# EAGLE design SMARTCONTROL (EAGLE 9.4.2)
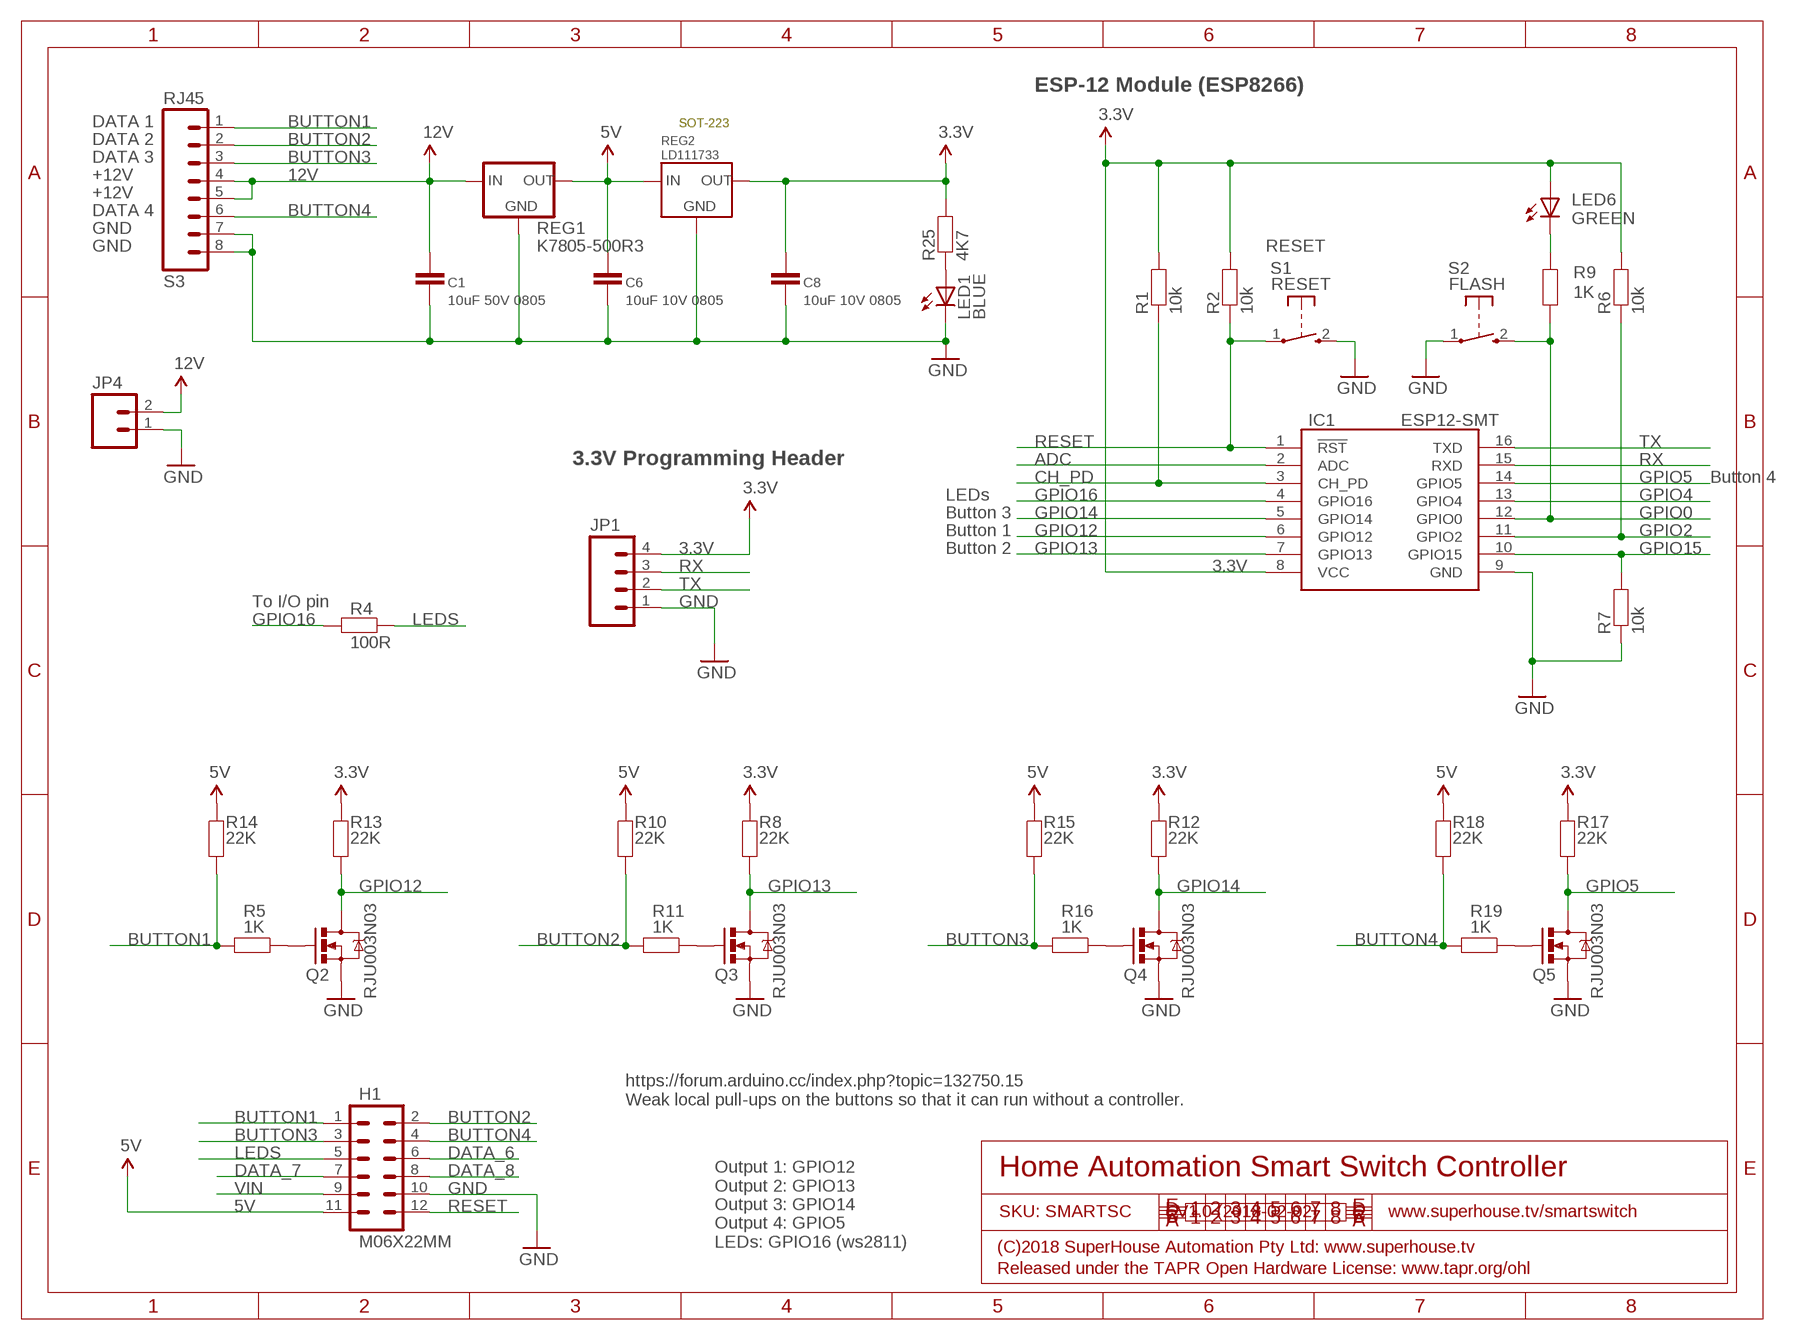
[diagram p0: schematic, sheet 1]

## Parts
C1  10uF 50V 0805  CAP0805  [C0805]
C6  10uF 10V 0805  CAP0805  [C0805]
C8  10uF 10V 0805  CAP0805  [C0805]
H1  M06X22MM  [2X6-2MM]
IC1  ESP12-SMT  [ESP12]
JP1  M04PTH  [1X04]
JP4  M023.5MM  [SCREWTERMINAL-3.5MM-2]
LED1  BLUE  LED0603  [LED-0603]
LED6  GREEN  LED0603  [LED-0603]
Q2  RJU003N03  MOSFET-NCHANNEL-323  [SOT32-3]
Q3  RJU003N03  MOSFET-NCHANNEL-323  [SOT32-3]
Q4  RJU003N03  MOSFET-NCHANNEL-323  [SOT32-3]
Q5  RJU003N03  MOSFET-NCHANNEL-323  [SOT32-3]
R1  10k  RESISTOR0603  [R0603]
R2  10k  RESISTOR0603  [R0603]
R4  100R  RESISTOR0603  [R0603]
R5  1K  RESISTOR0603  [R0603]
R6  10k  RESISTOR0603  [R0603]
R7  10k  RESISTOR0603  [R0603]
R8  22K  RESISTOR0603  [R0603]
R9  1K  RESISTOR0603  [R0603]
R10  22K  RESISTOR0603  [R0603]
R11  1K  RESISTOR0603  [R0603]
R12  22K  RESISTOR0603  [R0603]
R13  22K  RESISTOR0603  [R0603]
R14  22K  RESISTOR0603  [R0603]
R15  22K  RESISTOR0603  [R0603]
R16  1K  RESISTOR0603  [R0603]
R17  22K  RESISTOR0603  [R0603]
R18  22K  RESISTOR0603  [R0603]
R19  1K  RESISTOR0603  [R0603]
R25  4K7  RESISTOR0603  [R0603]
REG1  K7805-500R3  K78XX-500R3  [K78XX-500R3]
REG2  LD111733  LD1117  [SOT-223]
S1  RESET  TAC_SWITCH_2PINSMT  [TACTILE_SMD_3X4X2]
S2  FLASH  TAC_SWITCH_2PINSMT  [TACTILE_SMD_3X4X2]
S3  RJ45  [RJ45]

## Nets
3.3V: C8.1 IC1.8(VCC) JP1.4 LED6.A R1.2 R2.2 R6.2 R8.2 R12.2 R13.2 R17.2 R25.2 REG2.2(OUT) REG2.4(OUT)
5V: C6.1 H1.11 R10.2 R14.2 R15.2 R18.2 REG1.3(OUT) REG2.3(IN)
12V: C1.1 JP4.2 REG1.1(IN) S3.4 S3.5
ADC: IC1.2(ADC)
BUTTON1: H1.1 R5.2 R14.1 S3.1
BUTTON2: H1.2 R10.1 R11.2 S3.2
BUTTON3: H1.3 R15.1 R16.2 S3.3
BUTTON4: H1.4 R18.1 R19.2 S3.6
CH_PD: IC1.3(CH_PD) R1.1
DATA_6: H1.6
DATA_7: H1.7
DATA_8: H1.8
GND: C1.2 C6.2 C8.2 H1.10 IC1.9(GND) JP1.1 JP4.1 LED1.C Q2.2(S) Q3.2(S) Q4.2(S) Q5.2(S) R7.1 REG1.2(GND) REG2.1(GND) S1.2(S) S2.1(P) S3.7 S3.8
GPIO0: IC1.12(GPIO0) R9.2 S2.2(S)
GPIO2: IC1.11(GPIO2) R6.1
GPIO4: IC1.13(GPIO4)
GPIO5: IC1.14(GPIO5) Q5.3(D) R17.1
GPIO12: IC1.6(GPIO12) Q2.3(D) R13.1
GPIO13: IC1.7(GPIO13) Q3.3(D) R8.1
GPIO14: IC1.5(GPIO14) Q4.3(D) R12.1
GPIO15: IC1.10(GPIO15) R7.2
GPIO16: IC1.4(GPIO16) R4.2
LEDS: H1.5 R4.1
N$1: Q2.1(G) R5.1
N$2: Q3.1(G) R11.1
N$3: Q4.1(G) R16.1
N$4: Q5.1(G) R19.1
N$23: LED1.A R25.1
N$27: LED6.C R9.1
RESET: H1.12 IC1.1(!RST) R2.1 S1.1(P)
RX: IC1.15(RXD) JP1.3
TX: IC1.16(TXD) JP1.2
VIN: H1.9

## Notes on the sheet
- ESP-12 Module (ESP8266)
- DATA 1 | SOT-223
- DATA 2
- DATA 3
- +12V
- +12V
- DATA 4
- GND
- GND
- 3.3V Programming Header
- Button 4
- LEDs
- Button 3
- Button 1
- Button 2
- To I/O pin
- https://forum.arduino.cc/index.php?topic=132750.15
  Weak local pull-ups on the buttons so that it can run without a controller.
- Home Automation Smart Switch Controller
- SKU: SMARTSC | V1.0 (2018-02-02) | www.superhouse.tv/smartswitch
- Output 1: GPIO12
  Output 2: GPIO13
  Output 3: GPIO14
  Output 4: GPIO5
  LEDs: GPIO16 (ws2811)
- (C)2018 SuperHouse Automation Pty Ltd: www.superhouse.tv
- Released under the TAPR Open Hardware License: www.tapr.org/ohl

## Library data of the parts
C1 C6 C8 = SuperHouse-DiscreteSemi:CAP: Capacitor Standard ceramic capacitor
H1 = freetronics-jon:M06X2
IC1 = SuperHouse-MCUs:ESP12: ESP-12 module
JP1 = freetronics-jon:M04: Header 4 Standard 4-pin 0.1" header. Use with straight break away headers (SKU : PRT-00116), right angle break away headers (PRT-00553), swiss pins (PRT-00743), machine pins (PRT-00117), and female headers (PRT-00115). Molex polarized connector foot print use with SKU : PRT-08231 with associated crimp pins and housings. 1MM SMD Version SKU: PRT-10208
JP4 = freetronics-jon:M02: Header 2 Standard 2-pin 0.1" header. Use with straight break away headers (SKU : PRT-00116), right angle break away headers (PRT-00553), swiss pins (PRT-00743), machine pins (PRT-00117), and female headers (PRT-00115). Molex polarized connector foot print use with SKU : PRT-08233 with associated crimp pins and housings.
LED1 LED6 = SuperHouse-LEDs:LED: LEDs Standard schematic elements and footprints for 5mm, 3mm, 1206, and 0603 sized LEDs. 5mm - Spark Fun Electronics SKU : COM-00529 (and others)
Q2-Q5 = SuperHouse-DiscreteSemi:MOSFET-NCHANNEL: N-channel MOSFET
R1 R2 R4-R19 R25 = SuperHouse-DiscreteSemi:RESISTOR: Resistor Standard resistors.
REG1 = SuperHouse-Regulators:K78XX-500R3: K78xx-500R3 switchmode voltage regulator
REG2 = SuperHouse-Regulators:LD1117: Fixed-voltage LD1117 series LDOs in SOT-223 package. Note that the ground pin is labelled as ground, not as adj, because it's not the adjustable-voltage part.
S1 S2 = SuperHouse-Switches:TAC_SWITCH_2PIN: Momentary Tactile Switch - 2 pin Uxcell 3x4x2mm switch with 2 SMT pads
S3 = SuperHouse-Connectors:RJ45

## Net classes
0 Default: width 0.203 mm
1 VCC: width 0.305 mm

## Board
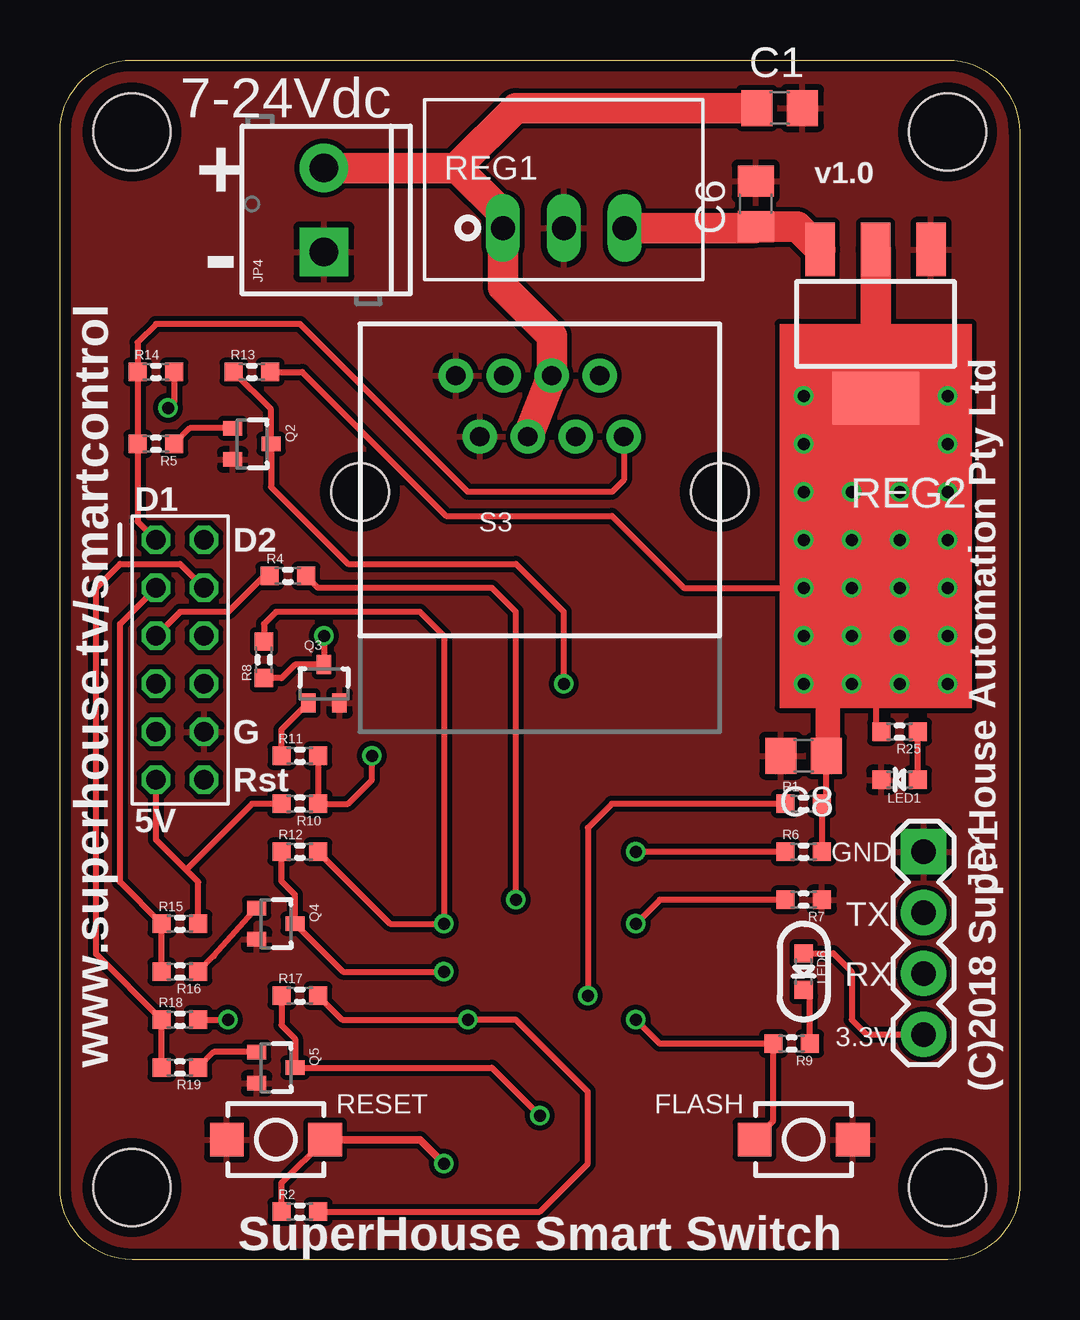
[diagram p1: board, top side]
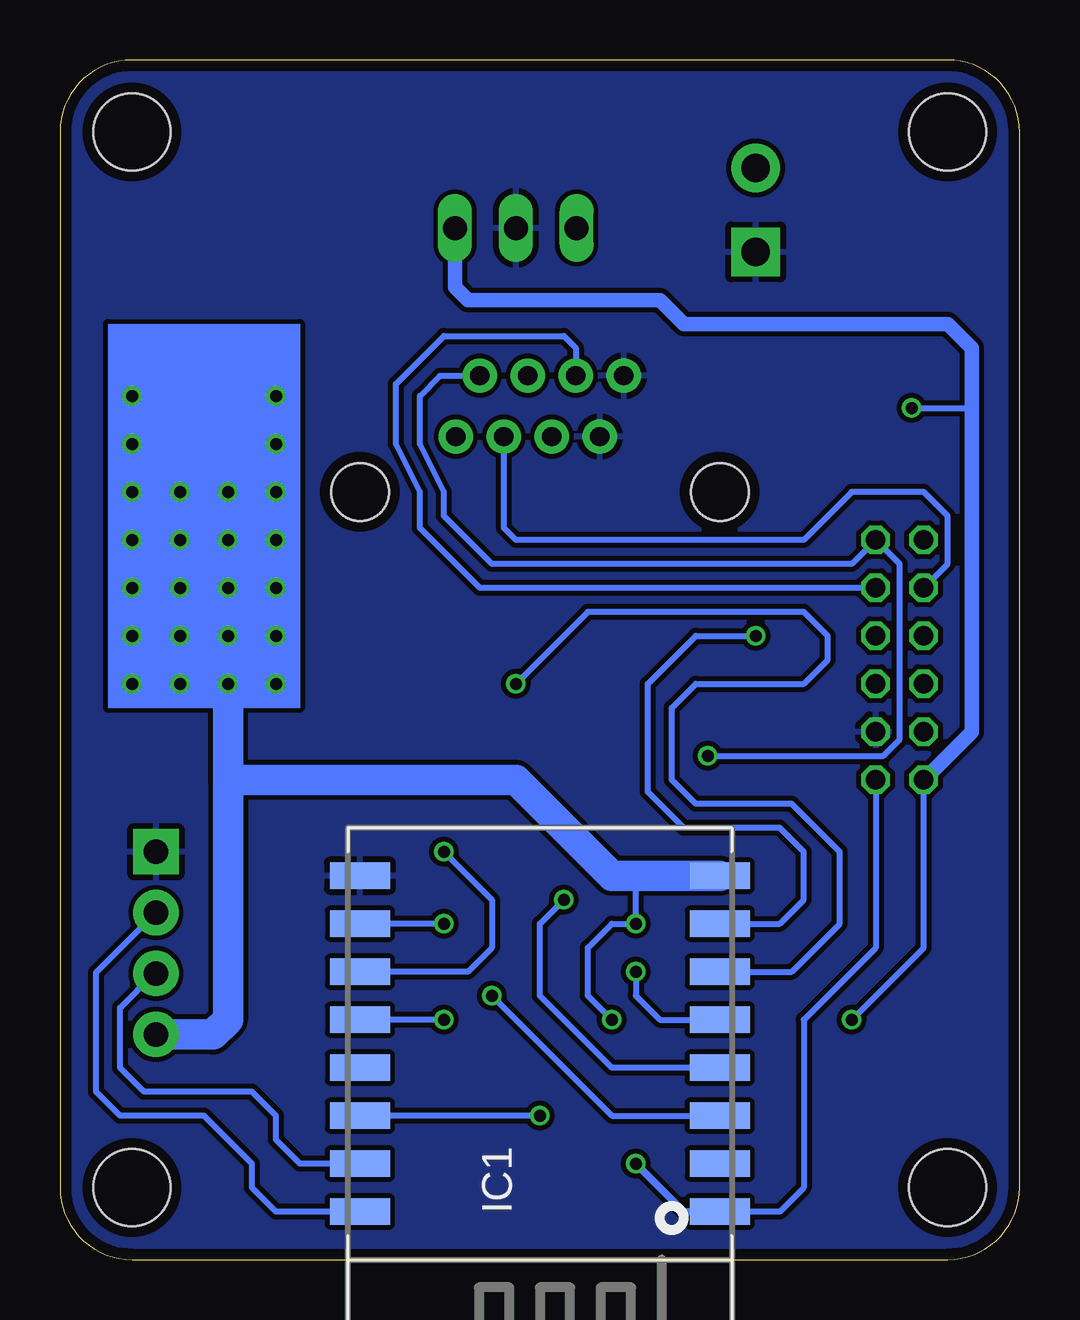
[diagram p2: board, bottom side, seen from below]

Size 40 x 50 mm. Coordinates in mm from the lower left corner, seen from the top.
Outline: 37,0 3,0 arc-90 0,3 0,47 arc-90 3,50 37,50 arc-90 40,47 40,3 arc-90 37,0
Copper layers (1*16): Top 0.035mm / dielectric 1.5mm / Bottom 0.035mm
Design rules "default *": minimum track width 8mil, minimum drill 15mil, track to track 8mil, track to pad 8mil, pad to pad 8mil, via to via 8mil, smd to smd 8mil, copper to edge 18mil, drill to drill 8mil, minimum pad ring 8mil, minimum via ring 6mil, stop-mask expansion 4mil, vias tented up to drill 25mil, thermal gap 10mil
Holes 3.2 mm at 3,3 3,47 37,47 37,3

### Footprints (pad centres in the part's own frame; a part is rotated, then mirrored left to right if it is on the bottom)
C0805 = smd 1.3 x 1.5: 1 -0.95,0; 2 0.95,0
2X6-2MM = drill 0.8 octagon: 1 0,0; 2 2,0; 3 0,-2; 4 2,-2; 5 0,-4; 6 2,-4; 7 0,-6; 8 2,-6; 9 0,-8; 10 2,-8; 11 0,-10; 12 2,-10
ESP12 = smd 1.1 x 2.5: 1 -4,-7.5; 2 -2,-7.5; 3 0,-7.5; 4 2,-7.5; 5 4,-7.5; 6 6,-7.5; 7 8,-7.5; 8 10,-7.5; 9 10,7.5; 10 8,7.5; 11 6,7.5; 12 4,7.5; 13 2,7.5; 14 0,7.5; 15 -2,7.5; 16 -4,7.5
1X04 = drill 1.016 pad 1.88 square: 1 0,0 | drill 1.016 pad 1.88: 2 2.54,0; 3 5.08,0; 4 7.62,0
SCREWTERMINAL-3.5MM-2 = drill 1.2 pad 2.032 square: 1 0,0 | drill 1.2 pad 2.032: 2 3.5,0
LED-0603 = smd 0.762 x 0.762: A -0.762,0; C 0.762,0
SOT32-3 = smd 0.6 x 0.8: 1 -0.65,-0.8; 2 0.65,-0.8; 3 0,0.8
0603 = smd 0.762 x 0.762: 1 -0.762,0; 2 0.762,0
K78XX-500R3 = drill 1 long: 1 -2.54,0; 2 0,0; 3 2.54,0
SOT-223 = smd 1.219 x 2.235: 1 -2.311,-3.099; 2 0,-3.099; 3 2.311,-3.099 | smd 3.6 x 2.2: 4 0,3.099
TACTILE_SWITCH_SMD_2PIN_TINY = smd 1.4 x 1.4: 1 -2.05,0; 2 2.05,0
RJ45 = drill 0.8 pad 1.422: 1 3.5,2.3; 2 2.5,4.84; 3 1.5,2.3; 4 0.5,4.84; 5 -0.5,2.3; 6 -1.5,4.84; 7 -2.5,2.3; 8 -3.5,4.84 | hole 2.4: -7.5,0; 7.5,0

### Placement (x,y rotation side)
C1  30,48 0 top
C6  29,44 90 top
C8  31,21 180 top
H1  4,30 0 top
IC1  ESP12SMT  [ESP12]  20,6 90 bottom
JP1  36,17 270 top
JP4  11,42 90 top
LED1  35,20 180 top
LED6  31,12 270 top
Q2  8,34 270 top
Q3  11,24 0 top
Q4  9,14 270 top
Q5  9,8 270 top
R1  10k  [0603]  31,19 0 top
R2  10k  [0603]  10,2 0 top
R4  100R  [0603]  9.5,28.5 0 top
R5  1K  [0603]  4,34 180 top
R6  10k  [0603]  31,17 0 top
R7  10k  [0603]  31,15 180 top
R8  22K  [0603]  8.5,25 90 top
R9  1K  [0603]  30.5,9 180 top
R10  22K  [0603]  10,19 180 top
R11  1K  [0603]  10,21 0 top
R12  22K  [0603]  10,17 0 top
R13  22K  [0603]  8,37 0 top
R14  22K  [0603]  4,37 0 top
R15  22K  [0603]  5,14 0 top
R16  1K  [0603]  5,12 180 top
R17  22K  [0603]  10,11 0 top
R18  22K  [0603]  5,10 0 top
R19  1K  [0603]  5,8 180 top
R25  4K7  [0603]  35,22 180 top
REG1  21,43 0 top
REG2  34,39 180 top
S1  RESET  [TACTILE_SWITCH_SMD_2PIN_TINY]  9,5 180 top
S2  FLASH  [TACTILE_SWITCH_SMD_2PIN_TINY]  31,5 180 top
S3  20,32 0 top

### Tracks (layer width: path | path; a pad name or v marks a point on that pad's centre or on a via)
3.3V  (via drill 0.5)
  Top 0.254: R6.2 R1.2 31.95,19.19 C8.1 | REG2.4 34,22.24 R25.2 | R2.2 20,2 22,4 22,7 19,10 v17,10 11.76,10 R17.2 | R13.2 10.09,37 16.09,31 23,31 26,28 v31,28 | LED6.A 32.24,12.76 33,12 33,10 33.62,9.38 JP1.4 | R12.2 13.76,14 v16,14 16,26 15,27 9,27 8.5,26.5 R8.2
  Top 0.305: v31,36 33.9,36 REG2.4 | LED6.A 31.24,13
  Top 1.016: C8.1 32,21.05 32,24 v33,24
  Top 1.27: REG2.2 REG2.4
  Bottom 0.254: v17,10 18,11 18,13 17,14 v16,14 16,16
  Bottom 0.305: v37,24 v35,24 v35,26 | v33,24 v31,24 v31,26 | v31,28 v31,26 | v31,26 v33,26 v33,28 34,29 34,30 | v31,30 v31,32 | v31,32 v33,32 v33,30 34,30 | v31,36 v31,34 v31,32 | v37,36 v37,34 v37,32 | v37,32 v35,32 v35,30 | v35,30 34,30 | v37,32 v37,30 v37,28 v37,26 v35,26 | v35,30 v35,28 v35,26
  Bottom 1.27: 33,20 33,10 33.62,9.38 JP1.4 | 33,20 v33,24 34,29 | IC1.8 16,16 17,16 21,20 33,20
5V  (via drill 0.5)
  Top 0.254: R15.2 5.76,15.74 5.25,16.25 | 5.25,16.25 4,17.5 H1.11 | R18.2 v7,10 | R10.2 8,19 5.25,16.25 | R14.2 4.76,35.76 v4.5,35.5
  Top 1.27: REG1.3 28.95,43 C6.1 30.74,43.05 REG2.3
  Bottom 0.254: v7,10 4,13 H1.11 | v4.5,35.5 2,35.5
  Bottom 0.61: REG1.3 23.54,40.54 23,40 15,40 14,39 3,39 2,38 2,35.5 2,22 H1.11
12V
  Top 1.27: JP4.2 16.55,45.5 | 16.55,45.5 16.55,45.55 19,48 C1.1 | 16.55,45.5 18.46,43.59 REG1.1 18.46,40.54 20.5,38.5 S3.4 S3.5
BUTTON1
  Top 0.254: S3.1 23.5,32.5 23,32 17,32 10,39 4,39 3.24,38.24 R14.1 R5.2 3.24,30.76 H1.1
BUTTON2  (via drill 0.5)
  Top 0.254: v13,21 13,20 12,19 R10.1 R11.2
  Bottom 0.254: v13,21 5.68,21 5,21.68 5,29 H1.2 7,29 22,29 24,31 24,32 25,34 25,36 24.16,36.84 S3.2
BUTTON3
  Top 0.254: R16.2 R15.1 2.5,15.74 2.5,26.5 H1.3
  Bottom 0.254: S3.3 21.5,30.5 21,30 9,30 7,32 4,32 3,31 3,29 H1.3
BUTTON4
  Top 0.254: R19.2 R18.1 1.5,12.74 1.5,28 2.5,29 5,29 H1.4
  Bottom 0.254: H1.4 22.5,28 25,30.5 25,32 26,34 26,36.5 24,38.5 19,38.5 18.5,38 S3.6
CH_PD  (via drill 0.5)
  Top 0.254: R1.1 23,19 22,18 v22,11
  Bottom 0.254: v22,11 17,6 IC1.3
GND
  pour Top: 37,50 3,50 arc90 0,47 0,3 arc90 3,0 37,0 arc90 40,3 40,47 arc90
  pour Bottom: 37,50 3,50 arc90 0,47 0,3 arc90 3,0 37,0 arc90 40,3 40,47 arc90
GPIO0  (via drill 0.5)
  Top 0.254: S2.2 29.74,5.79 R9.2 25,9 v24,10
  Bottom 0.254: v24,10 IC1.12
GPIO2  (via drill 0.5)
  Top 0.254: R6.1 v24,17
  Bottom 0.254: v24,17 22,15 22,13 23,12 IC1.11
GPIO5  (via drill 0.5)
  Top 0.254: R17.1 9.24,9.76 9.8,9.2 Q5.3 18,8 v20,6
  Bottom 0.254: v20,6 IC1.14
GPIO12  (via drill 0.5)
  Top 0.254: R13.1 8.8,35.44 Q2.3 8.8,32.2 12,29 19,29 21,27 v21,24
  Bottom 0.254: IC1.6 9.5,12 7.5,14 7.5,17 9.5,19 13.5,19 14.5,20 14.5,23 13.5,24 9,24 8,25 8,26 9,27 18,27 v21,24
GPIO13  (via drill 0.5)
  Top 0.254: v11,26 Q3.3 9.8,24.8 9.24,24.24 R8.1
  Bottom 0.254: IC1.7 10,14 9,15 9,17 10,18 14,18 15.5,19.5 15.5,24 13.5,26 v11,26
GPIO14  (via drill 0.5)
  Top 0.254: v16,12 11.8,12 Q4.3 9.8,15.2 9.24,15.76 R12.1
  Bottom 0.254: v16,12 16,11 15,10 IC1.5
GPIO15  (via drill 0.5)
  Top 0.254: R7.2 25,15 v24,14
  Bottom 0.254: v24,14 IC1.10
GPIO16  (via drill 0.5)
  Top 0.254: v19,15 19,27 18,28 10.76,28 R4.2
  Bottom 0.254: IC1.4 17,8 20,11 20,14 v19,15
LEDS
  Top 0.254: R4.1 8.5,28.5 7,27 5,27 H1.5
N$1
  Top 0.254: Q2.1 5.41,34.65 R5.1
N$2
  Top 0.254: R11.1 9.24,22.09 Q3.1
N$3
  Top 0.254: Q4.1 6.41,12.65 R16.1
N$4
  Top 0.254: Q5.1 6.41,8.65 R19.1
N$23
  Top 0.254: LED1.A R25.1
N$27
  Top 0.254: R9.1 31.26,10.98 LED6.C
RESET  (via drill 0.5)
  Top 0.254: R2.1 9.24,3.19 S1.1
  Top 0.305: S1.1 15,5 v16,4
  Bottom 0.254: H1.12 6,13 9,10 9,3 10,2 IC1.1
  Bottom 0.305: v16,4 14,2 IC1.1
RX
  Bottom 0.254: IC1.15 30,4 31,5 31,6 32,7 36.5,7 37.5,8 37.5,10.5 36.08,11.92 JP1.3
TX
  Bottom 0.254: IC1.16 31,2 32,3 32,4 34,6 37.5,6 38.5,7 38.5,11.96 JP1.2
(copper drawn outside any net)
  shapes: Bottom area x1, Top area x1

### Text on the board
tPlace: 7-24Vdc | v1.0 | + | - | D1 | D2 | G | Rst | 5V | GND | TX | RX | 3.3V | www.superhouse.tv/smartcontrol | (C)2018 SuperHouse Automation Pty Ltd | RESET | FLASH | SuperHouse Smart Switch